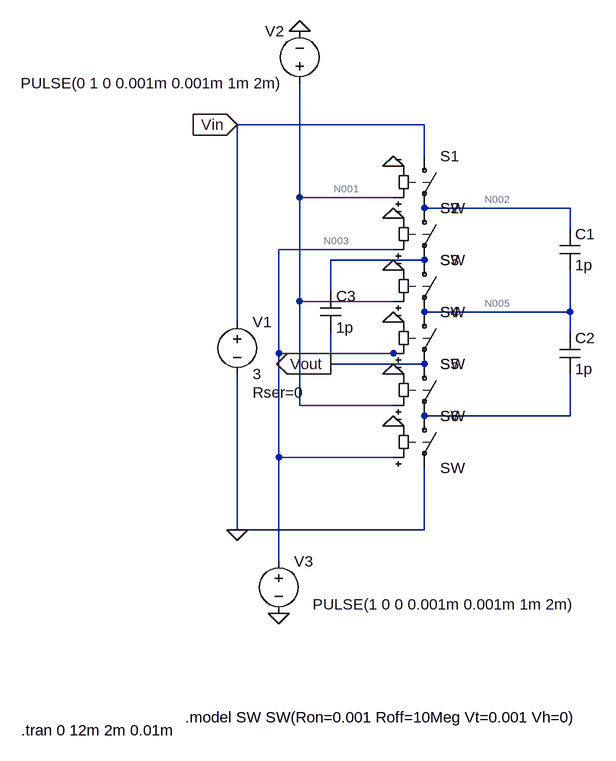
[diagram p0: schematic ladder_3to1.asc]
ladder_3to1.asc, the LTspice schematic file:
Version 4
SHEET 1 880 772
WIRE 352 -176 64 -176
WIRE 352 -128 352 -176
WIRE 160 -64 160 -240
WIRE 304 -64 160 -64
WIRE 576 -48 352 -48
WIRE 576 -16 576 -48
WIRE 304 16 128 16
WIRE 352 32 208 32
WIRE 208 80 208 32
WIRE 160 96 160 -64
WIRE 304 96 160 96
WIRE 576 112 576 48
WIRE 576 112 352 112
WIRE 64 128 64 -176
WIRE 576 144 576 112
WIRE 128 176 128 16
WIRE 304 176 128 176
WIRE 320 176 304 176
WIRE 208 192 208 144
WIRE 352 192 208 192
WIRE 160 256 160 96
WIRE 304 256 160 256
WIRE 576 272 576 208
WIRE 576 272 352 272
WIRE 128 336 128 176
WIRE 304 336 128 336
WIRE 64 448 64 208
WIRE 352 448 352 352
WIRE 352 448 64 448
WIRE 128 496 128 336
FLAG 128 576 0
FLAG 304 288 0
FLAG 304 208 0
FLAG 304 128 0
FLAG 304 48 0
FLAG 304 -32 0
FLAG 304 -112 0
FLAG 160 -320 0
FLAG 64 -176 Vin
IOPIN 64 -176 In
FLAG 208 192 Vout
IOPIN 208 192 Out
FLAG 64 448 0
SYMBOL voltage 64 112 R0
WINDOW 123 0 0 Left 2
WINDOW 39 24 124 Left 2
SYMATTR InstName V1
SYMATTR Value 3
SYMATTR SpiceLine Rser=0
SYMBOL sw 352 -144 R0
SYMATTR InstName S1
SYMBOL sw 352 -64 R0
SYMATTR InstName S2
SYMBOL sw 352 16 R0
SYMATTR InstName S3
SYMBOL sw 352 96 R0
SYMATTR InstName S4
SYMBOL sw 352 176 R0
SYMATTR InstName S5
SYMBOL sw 352 256 R0
SYMATTR InstName S6
SYMBOL cap 560 -16 R0
SYMATTR InstName C1
SYMATTR Value 1p
SYMBOL cap 560 144 R0
SYMATTR InstName C2
SYMATTR Value 1p
SYMBOL cap 192 80 R0
SYMATTR InstName C3
SYMATTR Value 1p
SYMBOL voltage 128 480 R0
WINDOW 3 52 82 Left 2
WINDOW 123 0 0 Left 2
WINDOW 39 0 0 Left 2
SYMATTR InstName V3
SYMATTR Value PULSE(1 0 0 0.001m 0.001m 1m 2m)
SYMBOL voltage 160 -224 R180
WINDOW 0 24 96 Left 2
WINDOW 3 24 16 Left 2
WINDOW 123 0 0 Left 2
WINDOW 39 0 0 Left 2
SYMATTR InstName V2
SYMATTR Value PULSE(0 1 0 0.001m 0.001m 1m 2m)
TEXT -16 736 Left 2 !.model SW SW(Ron=0.001 Roff=10Meg Vt=0.001 Vh=0)
TEXT -268 756 Left 2 !.tran 0 12m 2m 0.01m

The netlist it stands for:
* ladder_3to1.asc
V1 Vin 0 3 Rser=0
S1 Vin N002 N001 0 SW
S2 N002 N004 N003 0 SW
S3 N004 N005 N001 0 SW
S4 N005 Vout N003 0 SW
S5 Vout N006 N001 0 SW
S6 N006 0 N003 0 SW
C1 N002 N005 1p
C2 N005 N006 1p
C3 N004 Vout 1p
V3 N003 0 PULSE(1 0 0 0.001m 0.001m 1m 2m)
V2 N001 0 PULSE(0 1 0 0.001m 0.001m 1m 2m)
.model SW SW(Ron=0.001 Roff=10Meg Vt=0.001 Vh=0)
.tran 0 12m 2m 0.01m
.backanno
.end

* Results of the author's LTspice run, read from the files saved beside the schematic
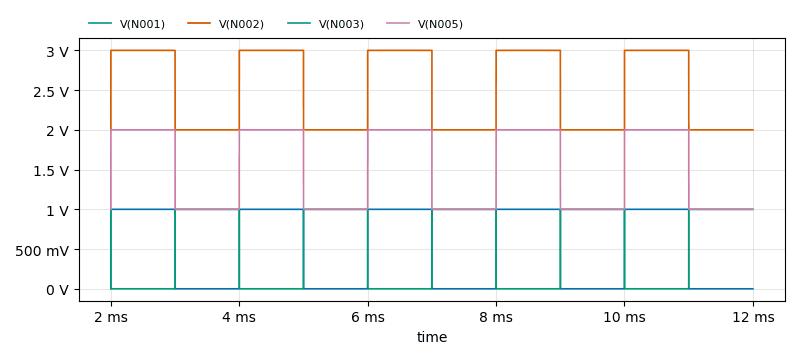
[diagram p1: Transient Analysis of ladder_3to1.asc, plotted from the saved traces]
* Transient Analysis, 1 run:
*   V(N001): min 0 V, max 1 V, average 500.5 mV, rms 707.4 mV, last 0 V
*   V(N002): min 2 V, max 3 V, average 2.5 V, rms 2.55 V, last 2 V
*   V(N003): min 0 V, max 1 V, average 499.5 mV, rms 706.6 mV, last 1 V
*   V(N005): min 1 V, max 2 V, average 1.5 V, rms 1.582 V, last 1 V